# Altium schematic sheet 光耦隔离.SchDoc
size A4
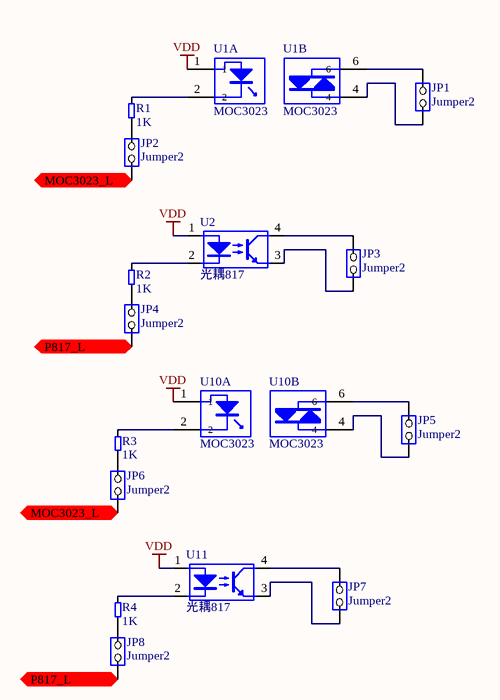
[diagram p0: 光耦隔离.SchDoc]

## Parts
JP1  Jumper2  [CON2-P2.54]
JP2  Jumper2  [CON2-P2.54]
JP3  Jumper2  [CON2-P2.54]
JP4  Jumper2  [CON2-P2.54]
JP5  Jumper2  [CON2-P2.54]
JP6  Jumper2  [CON2-P2.54]
JP7  Jumper2  [CON2-P2.54]
JP8  Jumper2  [CON2-P2.54]
R1  1K  [0603]
R2  1K  [0603]
R3  1K  [0603]
R4  1K  [0603]
U1  MOC3023  [SOP-6]  (parts A,B of 2)
U2  光耦817  [LC-SMD-4]
U10  MOC3023  [SOP-6]  (parts A,B of 2)
U11  光耦817  [LC-SMD-4]

## Ports
MOC3023_L, P817_L

## Nets
VDD: U1.1 U2.1(LED_Anode) U10.1 U11.1(LED_Anode)
MOC3023_L: JP2.1(COMMON) JP6.1(COMMON) ; port MOC3023_L
P817_L: JP4.1(COMMON) JP8.1(COMMON) ; port P817_L
NetJP1_1: JP1.1(COMMON) U1.4
NetJP1_2: JP1.2(NO) U1.6
NetJP2_2: JP2.2(NO) R1.1
NetJP3_1: JP3.1(COMMON) U2.3(Emitter)
NetJP3_2: JP3.2(NO) U2.4(Collector)
NetJP4_2: JP4.2(NO) R2.1
NetJP5_1: JP5.1(COMMON) U10.4
NetJP5_2: JP5.2(NO) U10.6
NetJP6_2: JP6.2(NO) R3.1
NetJP7_1: JP7.1(COMMON) U11.3(Emitter)
NetJP7_2: JP7.2(NO) U11.4(Collector)
NetJP8_2: JP8.2(NO) R4.1
NetR1_2: R1.2 U1.2
NetR2_2: R2.2 U2.2(LED_Cathode)
NetR3_2: R3.2 U10.2
NetR4_2: R4.2 U11.2(LED_Cathode)

## Library data of the parts
R1-R4 = Res1: 电阻; Specifications: ±1%; Published: 8-Jun-2000; LatestRevisionDate: 17-Jul-2002; LatestRevisionNote: Re-released for DXP Platform.; PackageReference: AXIAL-0.3; Publisher: Altium Limited; Value: 1K
U1 U10 = MOC3023: 光耦; Published: 24-Mar-1999; LatestRevisionDate: 17-Jul-2002; LatestRevisionNote: Re-released for DXP Platform.; PackageReference: NPSIP4A; Publisher: Altium Limited; Value: MOC3023